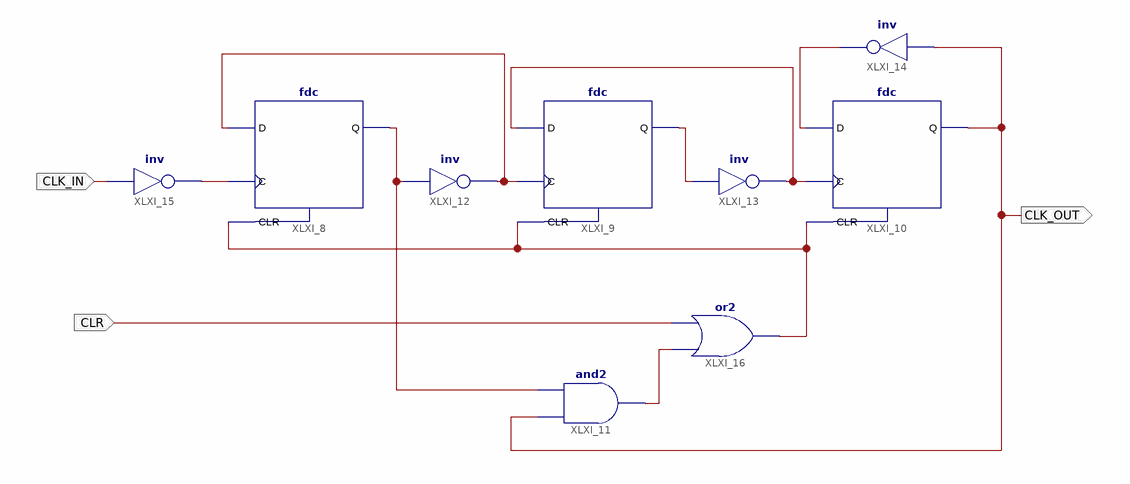
[diagram p0: schematic sheet 1]
// Xilinx ISE schematic diviser_5.sch (spartan6) as structural Verilog: 9 symbols, 3 ports
module diviser_5 (
  input  CLK_IN,
  input  CLR,
  output CLK_OUT
);

  wire XLXN_4, XLXN_7, XLXN_10, XLXN_12, XLXN_14, XLXN_16, XLXN_17, XLXN_21;

  fdc XLXI_8 (.C(XLXN_17), .CLR(XLXN_7), .D(XLXN_4), .Q(XLXN_10));
  fdc XLXI_9 (.C(XLXN_4), .CLR(XLXN_7), .D(XLXN_16), .Q(XLXN_14));
  fdc XLXI_10 (.C(XLXN_16), .CLR(XLXN_7), .D(XLXN_12), .Q(CLK_OUT));
  and XLXI_11 (XLXN_21, CLK_OUT, XLXN_10);
  not XLXI_12 (XLXN_4, XLXN_10);
  not XLXI_13 (XLXN_16, XLXN_14);
  not XLXI_14 (XLXN_12, CLK_OUT);
  not XLXI_15 (XLXN_17, CLK_IN);
  or XLXI_16 (XLXN_7, XLXN_21, CLR);
endmodule
